# EAGLE schematic Lichtsteuerung (EAGLE 6.6.0)

## Sheet 1 of 2
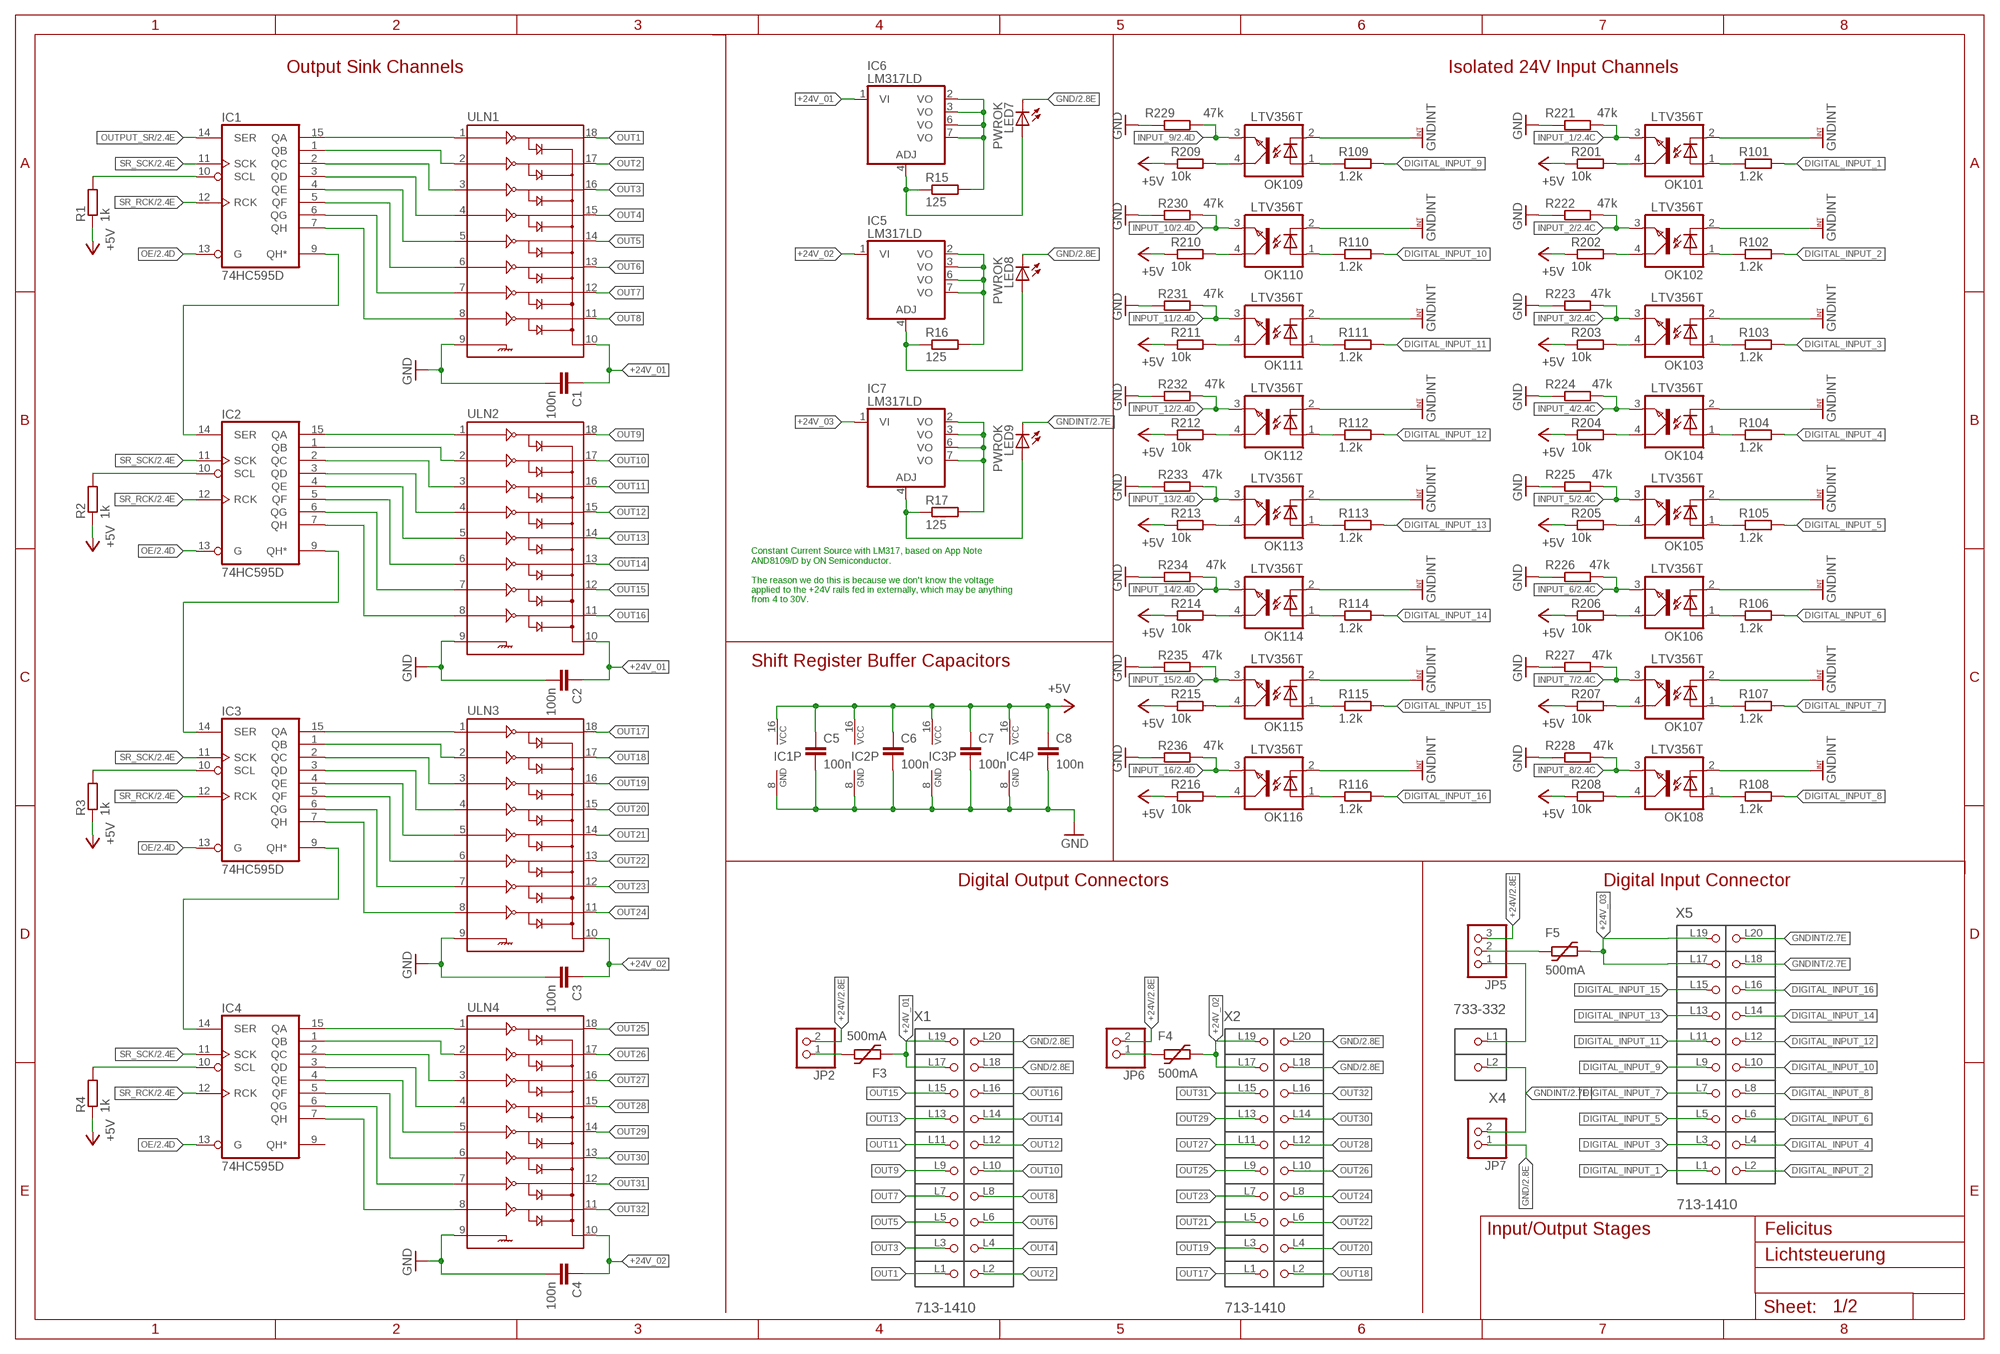
[diagram p0: schematic, sheet 1]

### Parts
C1  100n  C-EUC0805  [C0805]
C2  100n  C-EUC0805  [C0805]
C3  100n  C-EUC0805  [C0805]
C4  100n  C-EUC0805  [C0805]
C5  100n  C-EUC0805  [C0805]
C6  100n  C-EUC0805  [C0805]
C7  100n  C-EUC0805  [C0805]
C8  100n  C-EUC0805  [C0805]
F3  500mA  1812L  [1812L]
F4  500mA  1812L  [1812L]
F5  500mA  1812L  [1812L]
IC1  74HC595D  [SO16]
IC2  74HC595D  [SO16]
IC3  74HC595D  [SO16]
IC4  74HC595D  [SO16]
IC5  LM317LD  [SO08]
IC6  LM317LD  [SO08]
IC7  LM317LD  [SO08]
JP2  PINHD-1X2  [1X02]
JP5  PINHD-1X3  [1X03]
JP6  PINHD-1X2  [1X02]
JP7  PINHD-1X2  [1X02]
LED7  PWROK  LEDCHIP-LED0805  [CHIP-LED0805]
LED8  PWROK  LEDCHIP-LED0805  [CHIP-LED0805]
LED9  PWROK  LEDCHIP-LED0805  [CHIP-LED0805]
OK101  LTV356T  LTV816S  [SMD4]
OK102  LTV356T  LTV816S  [SMD4]
OK103  LTV356T  LTV816S  [SMD4]
OK104  LTV356T  LTV816S  [SMD4]
OK105  LTV356T  LTV816S  [SMD4]
OK106  LTV356T  LTV816S  [SMD4]
OK107  LTV356T  LTV816S  [SMD4]
OK108  LTV356T  LTV816S  [SMD4]
OK109  LTV356T  LTV816S  [SMD4]
OK110  LTV356T  LTV816S  [SMD4]
OK111  LTV356T  LTV816S  [SMD4]
OK112  LTV356T  LTV816S  [SMD4]
OK113  LTV356T  LTV816S  [SMD4]
OK114  LTV356T  LTV816S  [SMD4]
OK115  LTV356T  LTV816S  [SMD4]
OK116  LTV356T  LTV816S  [SMD4]
R1  1k  R-EU_R0805  [R0805]
R2  1k  R-EU_R0805  [R0805]
R3  1k  R-EU_R0805  [R0805]
R4  1k  R-EU_R0805  [R0805]
R15  125  R-EU_R0805  [R0805]
R16  125  R-EU_R0805  [R0805]
R17  125  R-EU_R0805  [R0805]
R101  1.2k  R-EU_R0805  [R0805]
R102  1.2k  R-EU_R0805  [R0805]
R103  1.2k  R-EU_R0805  [R0805]
R104  1.2k  R-EU_R0805  [R0805]
R105  1.2k  R-EU_R0805  [R0805]
R106  1.2k  R-EU_R0805  [R0805]
R107  1.2k  R-EU_R0805  [R0805]
R108  1.2k  R-EU_R0805  [R0805]
R109  1.2k  R-EU_R0805  [R0805]
R110  1.2k  R-EU_R0805  [R0805]
R111  1.2k  R-EU_R0805  [R0805]
R112  1.2k  R-EU_R0805  [R0805]
R113  1.2k  R-EU_R0805  [R0805]
R114  1.2k  R-EU_R0805  [R0805]
R115  1.2k  R-EU_R0805  [R0805]
R116  1.2k  R-EU_R0805  [R0805]
R201  10k  R-EU_R0805  [R0805]
R202  10k  R-EU_R0805  [R0805]
R203  10k  R-EU_R0805  [R0805]
R204  10k  R-EU_R0805  [R0805]
R205  10k  R-EU_R0805  [R0805]
R206  10k  R-EU_R0805  [R0805]
R207  10k  R-EU_R0805  [R0805]
R208  10k  R-EU_R0805  [R0805]
R209  10k  R-EU_R0805  [R0805]
R210  10k  R-EU_R0805  [R0805]
R211  10k  R-EU_R0805  [R0805]
R212  10k  R-EU_R0805  [R0805]
R213  10k  R-EU_R0805  [R0805]
R214  10k  R-EU_R0805  [R0805]
R215  10k  R-EU_R0805  [R0805]
R216  10k  R-EU_R0805  [R0805]
R221  47k  R-EU_R0805  [R0805]
R222  47k  R-EU_R0805  [R0805]
R223  47k  R-EU_R0805  [R0805]
R224  47k  R-EU_R0805  [R0805]
R225  47k  R-EU_R0805  [R0805]
R226  47k  R-EU_R0805  [R0805]
R227  47k  R-EU_R0805  [R0805]
R228  47k  R-EU_R0805  [R0805]
R229  47k  R-EU_R0805  [R0805]
R230  47k  R-EU_R0805  [R0805]
R231  47k  R-EU_R0805  [R0805]
R232  47k  R-EU_R0805  [R0805]
R233  47k  R-EU_R0805  [R0805]
R234  47k  R-EU_R0805  [R0805]
R235  47k  R-EU_R0805  [R0805]
R236  47k  R-EU_R0805  [R0805]
ULN1  ULN2803SOICW  [SO18L]
ULN2  ULN2803SOICW  [SO18L]
ULN3  ULN2803SOICW  [SO18L]
ULN4  ULN2803SOICW  [SO18L]
X1  713-1410  [P-713-1410]
X2  713-1410  [P-713-1410]
X4  733-332  [P-733-332]
X5  713-1410  [P-713-1410]

### Nets
+5V: C5.1 C6.1 C7.1 C8.1 IC1.16(VCC) IC2.16(VCC) IC3.16(VCC) IC4.16(VCC) R1.1 R2.1 R3.1 R4.1 R201.1 R202.1 R203.1 R204.1 R205.1 R206.1 R207.1 R208.1 R209.1 R210.1 R211.1 R212.1 R213.1 R214.1 R215.1 R216.1 ; also sheet 2
+24V [24v-2a]: JP2.2 JP5.3 JP6.2 ; also sheet 2
+24V_01 [24v-2a]: C1.1 C2.1 F3.P$1 IC6.1(VI) ULN1.10 ULN2.10 X1.L17 X1.L19
+24V_02 [24v-2a]: C3.1 C4.1 F4.P$2 IC5.1(VI) ULN3.10 ULN4.10 X2.L17 X2.L19
+24V_03 [24v-2a]: F5.P$2 IC7.1(VI) X5.L17 X5.L19
DIGITAL_INPUT_1: R101.2 X5.L1
DIGITAL_INPUT_2: R102.2 X5.L2
DIGITAL_INPUT_3: R103.2 X5.L3
DIGITAL_INPUT_4: R104.2 X5.L4
DIGITAL_INPUT_5: R105.2 X5.L5
DIGITAL_INPUT_6: R106.2 X5.L6
DIGITAL_INPUT_7: R107.2 X5.L7
DIGITAL_INPUT_8: R108.2 X5.L8
DIGITAL_INPUT_9: R109.2 X5.L9
DIGITAL_INPUT_10: R110.2 X5.L10
DIGITAL_INPUT_11: R111.2 X5.L11
DIGITAL_INPUT_12: R112.2 X5.L12
DIGITAL_INPUT_13: R113.2 X5.L13
DIGITAL_INPUT_14: R114.2 X5.L14
DIGITAL_INPUT_15: R115.2 X5.L15
DIGITAL_INPUT_16: R116.2 X5.L16
GND: C1.2 C2.2 C3.2 C4.2 C5.2 C6.2 C7.2 C8.2 IC1.8(GND) IC2.8(GND) IC3.8(GND) IC4.8(GND) JP7.1 LED7.C LED8.C R221.1 R222.1 R223.1 R224.1 R225.1 R226.1 R227.1 R228.1 R229.1 R230.1 R231.1 R232.1 R233.1 R234.1 R235.1 R236.1 ULN1.9 ULN2.9 ULN3.9 ULN4.9 X1.L18 X1.L20 X2.L18 X2.L20 ; also sheet 2
GNDINT: JP7.2 LED9.C OK101.2(C) OK102.2(C) OK103.2(C) OK104.2(C) OK105.2(C) OK106.2(C) OK107.2(C) OK108.2(C) OK109.2(C) OK110.2(C) OK111.2(C) OK112.2(C) OK113.2(C) OK114.2(C) OK115.2(C) OK116.2(C) X4.L2(P2) X5.L18 X5.L20 ; also sheet 2
INPUT_1: OK101.3(EMIT) R221.2 ; also sheet 2
INPUT_2: OK102.3(EMIT) R222.2 ; also sheet 2
INPUT_3: OK103.3(EMIT) R223.2 ; also sheet 2
INPUT_4: OK104.3(EMIT) R224.2 ; also sheet 2
INPUT_5: OK105.3(EMIT) R225.2 ; also sheet 2
INPUT_6: OK106.3(EMIT) R226.2 ; also sheet 2
INPUT_7: OK107.3(EMIT) R227.2 ; also sheet 2
INPUT_8: OK108.3(EMIT) R228.2 ; also sheet 2
INPUT_9: OK109.3(EMIT) R229.2 ; also sheet 2
INPUT_10: OK110.3(EMIT) R230.2 ; also sheet 2
INPUT_11: OK111.3(EMIT) R231.2 ; also sheet 2
INPUT_12: OK112.3(EMIT) R232.2 ; also sheet 2
INPUT_13: OK113.3(EMIT) R233.2 ; also sheet 2
INPUT_14: OK114.3(EMIT) R234.2 ; also sheet 2
INPUT_15: OK115.3(EMIT) R235.2 ; also sheet 2
INPUT_16: OK116.3(EMIT) R236.2 ; also sheet 2
N$1: IC1.15(QA) ULN1.1
N$2: IC1.1(QB) ULN1.2
N$3: IC1.2(QC) ULN1.3
N$4: IC1.3(QD) ULN1.4
N$5: IC1.4(QE) ULN1.5
N$6: IC1.5(QF) ULN1.6
N$7: IC1.6(QG) ULN1.7
N$8: IC1.7(QH) ULN1.8
N$9: IC2.15(QA) ULN2.1
N$10: IC2.1(QB) ULN2.2
N$11: IC2.2(QC) ULN2.3
N$12: IC2.3(QD) ULN2.4
N$13: IC2.4(QE) ULN2.5
N$14: IC2.5(QF) ULN2.6
N$15: IC2.6(QG) ULN2.7
N$16: IC2.7(QH) ULN2.8
N$17: IC3.15(QA) ULN3.1
N$18: IC3.1(QB) ULN3.2
N$19: IC3.2(QC) ULN3.3
N$20: IC3.3(QD) ULN3.4
N$21: IC3.4(QE) ULN3.5
N$22: IC3.5(QF) ULN3.6
N$23: IC3.6(QG) ULN3.7
N$24: IC3.7(QH) ULN3.8
N$25: IC4.15(QA) ULN4.1
N$26: IC4.1(QB) ULN4.2
N$27: IC4.2(QC) ULN4.3
N$28: IC4.3(QD) ULN4.4
N$29: IC4.4(QE) ULN4.5
N$30: IC4.5(QF) ULN4.6
N$31: IC4.6(QG) ULN4.7
N$32: IC4.7(QH) ULN4.8
N$33: IC1.9(QH*) IC2.14(SER)
N$34: IC2.9(QH*) IC3.14(SER)
N$35: IC3.9(QH*) IC4.14(SER)
N$36: IC1.10(SCL) R1.2
N$37: IC2.10(SCL) R2.2
N$38: IC3.10(SCL) R3.2
N$39: IC4.10(SCL) R4.2
N$46: F5.P$1 JP5.2
N$47: JP5.1 X4.L1(P1)
N$49: OK101.1(A) R101.1
N$50: OK101.4(COL) R201.2
N$51: OK102.1(A) R102.1
N$52: OK102.4(COL) R202.2
N$54: OK103.1(A) R103.1
N$55: OK103.4(COL) R203.2
N$56: OK104.1(A) R104.1
N$57: OK104.4(COL) R204.2
N$58: OK105.1(A) R105.1
N$59: OK105.4(COL) R205.2
N$60: OK106.1(A) R106.1
N$61: OK106.4(COL) R206.2
N$62: OK107.1(A) R107.1
N$63: OK107.4(COL) R207.2
N$64: OK108.1(A) R108.1
N$65: OK108.4(COL) R208.2
N$66: OK109.1(A) R109.1
N$67: OK109.4(COL) R209.2
N$68: OK110.1(A) R110.1
N$69: OK110.4(COL) R210.2
N$70: OK111.1(A) R111.1
N$74: F4.P$1 JP6.1
N$75: OK111.4(COL) R211.2
N$76: F3.P$2 JP2.1
N$78: OK112.1(A) R112.1
N$80: IC5.4(ADJ) LED8.A R16.1
N$81: OK112.4(COL) R212.2
N$82: IC5.2(VO) IC5.3(VO) IC5.6(VO) IC5.7(VO) R16.2
N$83: IC7.4(ADJ) LED9.A R17.1
N$84: OK113.1(A) R113.1
N$85: IC6.4(ADJ) LED7.A R15.1
N$86: IC6.2(VO) IC6.3(VO) IC6.6(VO) IC6.7(VO) R15.2
N$87: OK113.4(COL) R213.2
N$88: IC7.2(VO) IC7.3(VO) IC7.6(VO) IC7.7(VO) R17.2
N$90: OK114.1(A) R114.1
N$93: OK114.4(COL) R214.2
N$96: OK115.1(A) R115.1
N$105: OK115.4(COL) R215.2
N$107: OK116.1(A) R116.1
N$108: OK116.4(COL) R216.2
OE: IC1.13(G) IC2.13(G) IC3.13(G) IC4.13(G) ; also sheet 2
OUT1 [24v-500ma]: ULN1.18 X1.L1
OUT2 [24v-500ma]: ULN1.17 X1.L2
OUT3 [24v-500ma]: ULN1.16 X1.L3
OUT4 [24v-500ma]: ULN1.15 X1.L4
OUT5 [24v-500ma]: ULN1.14 X1.L5
OUT6 [24v-500ma]: ULN1.13 X1.L6
OUT7 [24v-500ma]: ULN1.12 X1.L7
OUT8 [24v-500ma]: ULN1.11 X1.L8
OUT9 [24v-500ma]: ULN2.18 X1.L9
OUT10 [24v-500ma]: ULN2.17 X1.L10
OUT11 [24v-500ma]: ULN2.16 X1.L11
OUT12 [24v-500ma]: ULN2.15 X1.L12
OUT13 [24v-500ma]: ULN2.14 X1.L13
OUT14 [24v-500ma]: ULN2.13 X1.L14
OUT15 [24v-500ma]: ULN2.12 X1.L15
OUT16 [24v-500ma]: ULN2.11 X1.L16
OUT17 [24v-500ma]: ULN3.18 X2.L1
OUT18 [24v-500ma]: ULN3.17 X2.L2
OUT19 [24v-500ma]: ULN3.16 X2.L3
OUT20 [24v-500ma]: ULN3.15 X2.L4
OUT21 [24v-500ma]: ULN3.14 X2.L5
OUT22 [24v-500ma]: ULN3.13 X2.L6
OUT23 [24v-500ma]: ULN3.12 X2.L7
OUT24 [24v-500ma]: ULN3.11 X2.L8
OUT25 [24v-500ma]: ULN4.18 X2.L9
OUT26 [24v-500ma]: ULN4.17 X2.L10
OUT27 [24v-500ma]: ULN4.16 X2.L11
OUT28 [24v-500ma]: ULN4.15 X2.L12
OUT29 [24v-500ma]: ULN4.14 X2.L13
OUT30 [24v-500ma]: ULN4.13 X2.L14
OUT31 [24v-500ma]: ULN4.12 X2.L15
OUT32 [24v-500ma]: ULN4.11 X2.L16
OUTPUT_SR: IC1.14(SER) ; also sheet 2
SR_RCK: IC1.12(RCK) IC2.12(RCK) IC3.12(RCK) IC4.12(RCK) ; also sheet 2
SR_SCK: IC1.11(SCK) IC2.11(SCK) IC3.11(SCK) IC4.11(SCK) ; also sheet 2
Unconnected: IC4.9(QH*)

### Notes on the sheet
- Output Sink Channels | Isolated 24V Input Channels
- Constant Current Source with LM317, based on App Note
  AND8109/D by ON Semiconductor.
  
  The reason we do this is because we don't know the voltage
  applied to the +24V rails fed in externally, which may be anything
  from 4 to 30V.
- Shift Register Buffer Capacitors
- Digital Output Connectors | Digital Input Connector
- Input/Output Stages | Felicitus

## Sheet 2 of 2
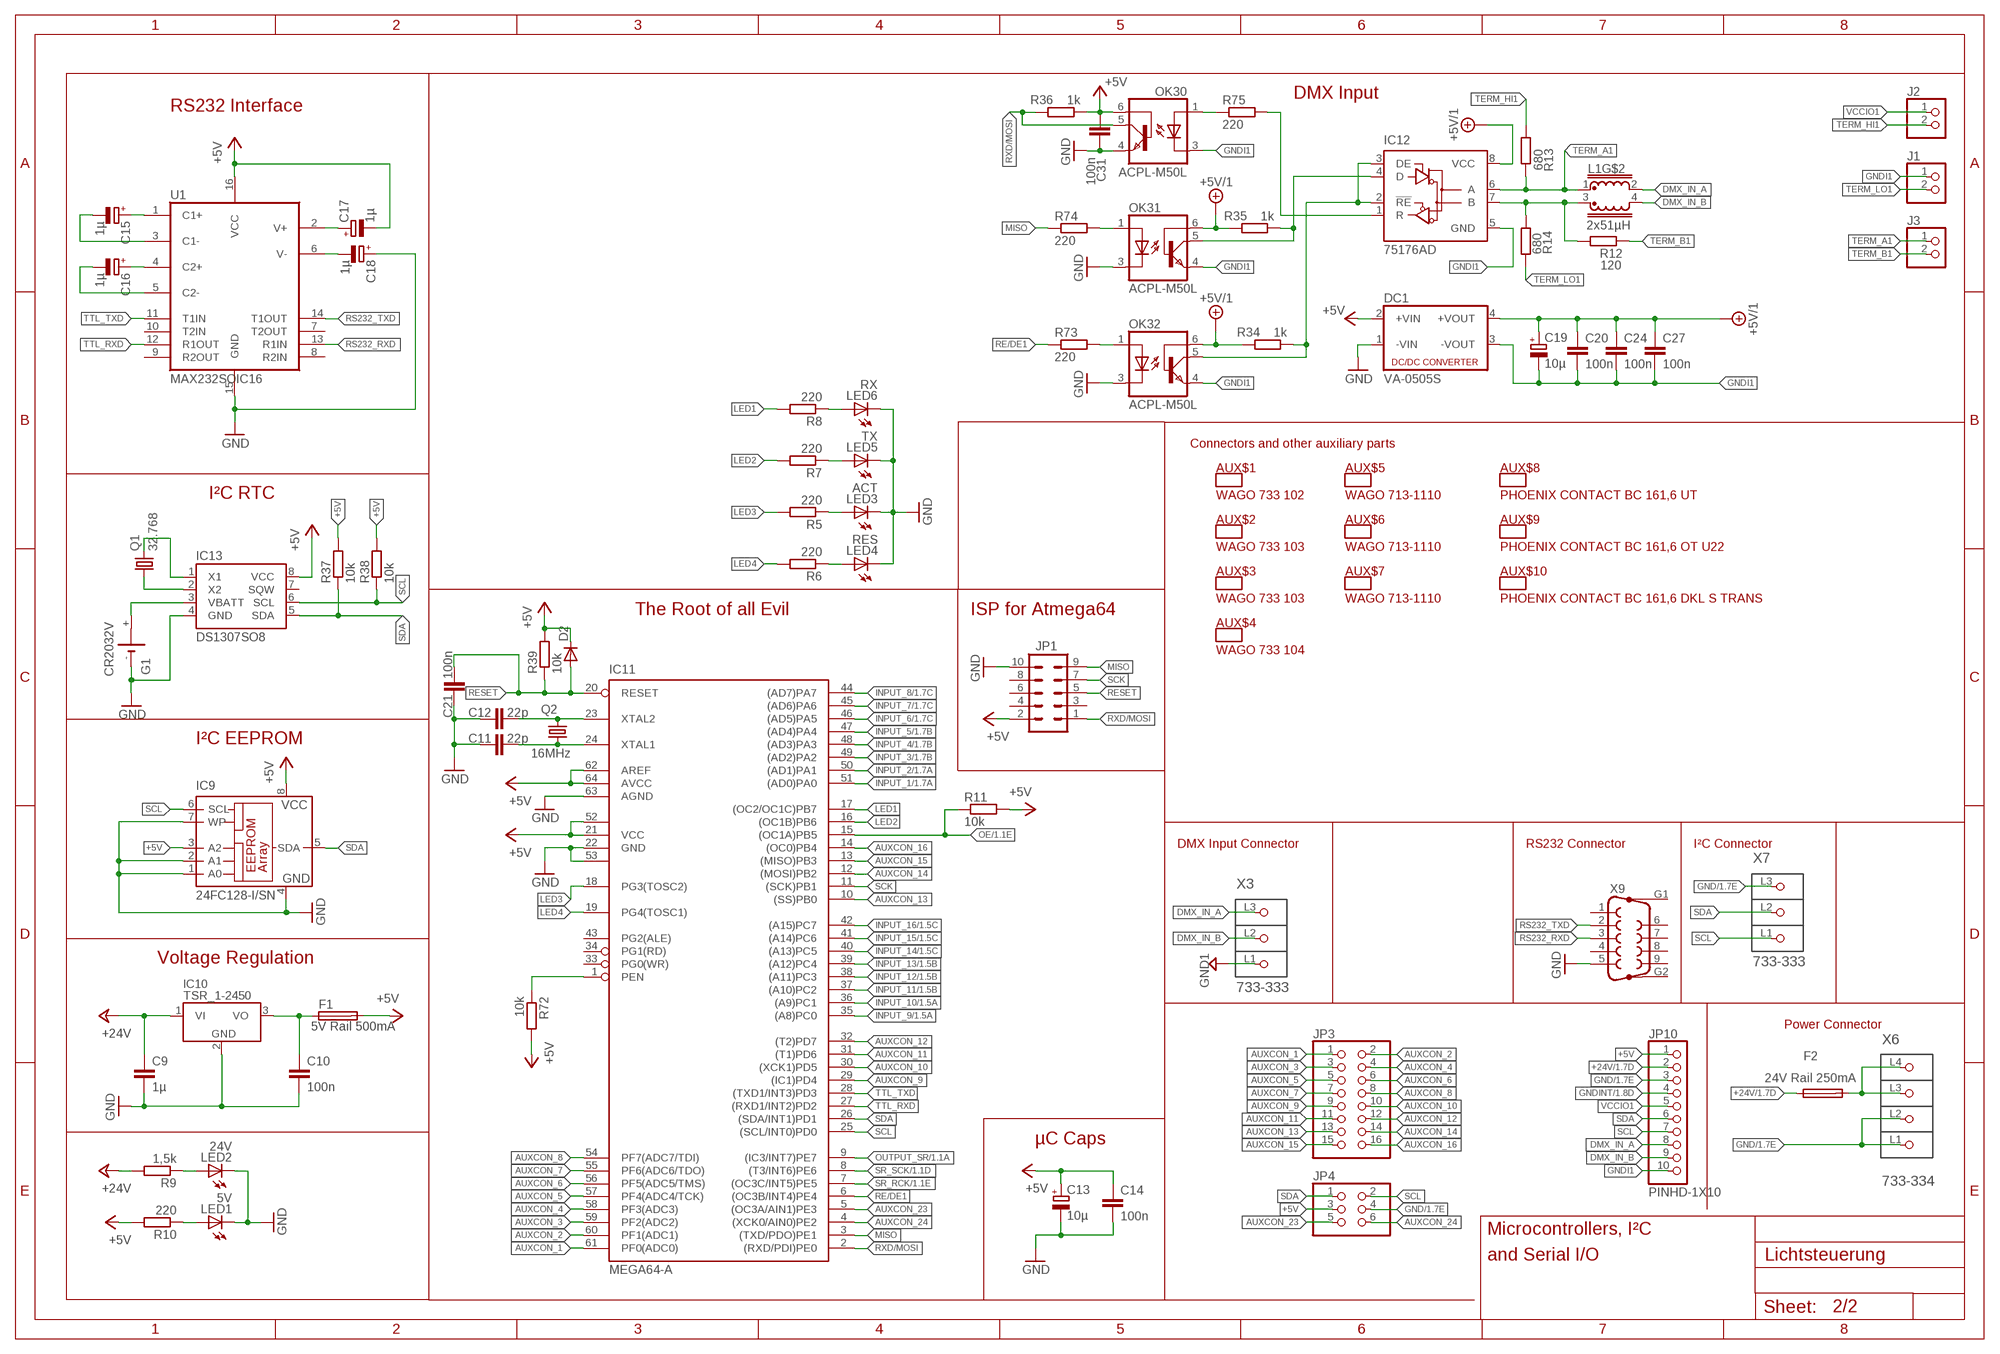
[diagram p1: schematic, sheet 2]
AUX$1 (DUMMY): OC_REICHELT: WAGO 733-102
AUX$2 (DUMMY): OC_REICHELT: WAGO 733-103
AUX$3 (DUMMY): OC_REICHELT: WAGO 733-103
AUX$4 (DUMMY): OC_REICHELT: WAGO 733-104
AUX$5 (DUMMY): OC_REICHELT: WAGO 713-1110
AUX$6 (DUMMY): OC_REICHELT: WAGO 713-1110
AUX$7 (DUMMY): OC_REICHELT: WAGO 713-1110
AUX$8 (DUMMY): OC_CONRAD: 702576
AUX$9 (DUMMY): OC_CONRAD: 702578
AUX$10 (DUMMY): OC_CONRAD: 702581

### Parts
C9  1µ  C-EUC0805  [C0805]
C10  100n  C-EUC0805  [C0805]
C11  22p  C-EUC0805  [C0805]
C12  22p  C-EUC0805  [C0805]
C13  10µ  CPOL-EUC/6032-28R  [C/6032-28R]
C14  100n  C-EUC0805  [C0805]
C15  1µ  CPOL-EUA/3216-18R  [A/3216-18R]
C16  1µ  CPOL-EUA/3216-18R  [A/3216-18R]
C17  1µ  CPOL-EUA/3216-18R  [A/3216-18R]
C18  1µ  CPOL-EUA/3216-18R  [A/3216-18R]
C19  10µ  CPOL-EUC/6032-28R  [C/6032-28R]
C20  100n  C-EUC0805  [C0805]
C21  100n  C-EUC0805  [C0805]
C24  100n  C-EUC0805  [C0805]
C27  100n  C-EUC0805  [C0805]
C31  100n  C-EUC0805  [C0805]
D2  DIODE-SOD323-R  [SOD323-R]
DC1  VA-0505S  [4SIL]
F1  5V Rail 500mA  SMD-MICRO-FUSE-BLOCK  [OMNIBLOK]
F2  24V Rail 250mA  SMD-MICRO-FUSE-BLOCK  [OMNIBLOK]
G1  CR2032V  [CR2032V2]
IC9  24FC128-I/SN  24AA01SM  [SO-08M]
IC10  TSR_1-2450  [TSR-1]
IC11  MEGA64-A  [TQFP64]
IC12  75176AD  [D_R-PDSO-G8]
IC13  DS1307SO8  [SO08]
J1  PINHD-1X2  [1X02]
J2  PINHD-1X2  [1X02]
J3  PINHD-1X2  [1X02]
JP1  ML10  [ML10]
JP3  PINHD-2X8  [2X08]
JP4  PINHD-2X3  [2X03]
JP10  PINHD-1X10  [1X10-BIG]
L1  2x51µH  EPCOS_B82790C0  [EPCOS_B82790_SERIES]
LED1  5V  LEDCHIP-LED0805  [CHIP-LED0805]
LED2  24V  LEDCHIP-LED0805  [CHIP-LED0805]
LED3  ACT  LEDCHIP-LED0805  [CHIP-LED0805]
LED4  RES  LEDCHIP-LED0805  [CHIP-LED0805]
LED5  TX  LEDCHIP-LED0805  [CHIP-LED0805]
LED6  RX  LEDCHIP-LED0805  [CHIP-LED0805]
OK30  ACPL-M50L  [JEDEC_MS-012-AA_SOIC5]
OK31  ACPL-M50L  [JEDEC_MS-012-AA_SOIC5]
OK32  ACPL-M50L  [JEDEC_MS-012-AA_SOIC5]
Q1  32.768  MC-306  [MC-306]
Q2  16MHz  CRYSTALMJ  [MJ]
R5  220  R-EU_R0805  [R0805]
R6  220  R-EU_R0805  [R0805]
R7  220  R-EU_R0805  [R0805]
R8  220  R-EU_R0805  [R0805]
R9  1,5k  R-EU_R0805  [R0805]
R10  220  R-EU_R0805  [R0805]
R11  10k  R-EU_R0805  [R0805]
R12  120  R-EU_R0805  [R0805]
R13  680  R-EU_R0805  [R0805]
R14  680  R-EU_R0805  [R0805]
R34  1k  R-EU_R0805  [R0805]
R35  1k  R-EU_R0805  [R0805]
R36  1k  R-EU_R0805  [R0805]
R37  10k  R-EU_R0805  [R0805]
R38  10k  R-EU_R0805  [R0805]
R39  10k  R-EU_R0805  [R0805]
R72  10k  R-EU_R0805  [R0805]
R73  220  R-EU_R0805  [R0805]
R74  220  R-EU_R0805  [R0805]
R75  220  R-EU_R0805  [R0805]
U1  MAX232SOIC16  [SO016]
X3  733-333  [P-733-333]
X6  733-334  [P-733-334]
X7  733-333  [P-733-333]
X9  F09VP  [F09VP]

### Nets
+5V: C13.+ C14.1 C17.- C31.1 D2.C DC1.2(+VIN) F1.P$2 IC9.3(A2) IC9.8(VCC) IC11.21(VCC) IC11.52(VCC1) IC11.62(AREF) IC11.64(AVCC) IC13.8(VCC) JP1.2 JP4.3 JP10.1 OK30.6(BAS) R10.2 R11.2 R36.1 R37.2 R38.2 R39.2 R72.2 U1.16(VCC) ; also sheet 1
+24V [24v-2a]: C9.1 F2.P$1 IC10.1(VI) JP10.2 R9.2 ; also sheet 1
+24VIN [24v-2a]: F2.P$2 X6.L3(P3) X6.L4(P4)
AUXCON_1: IC11.61(PF0(ADC0)) JP3.1
AUXCON_2: IC11.60(PF1(ADC1)) JP3.2
AUXCON_3: IC11.59(PF2(ADC2)) JP3.3
AUXCON_4: IC11.58(PF3(ADC3)) JP3.4
AUXCON_5: IC11.57(PF4(ADC4/TCK)) JP3.5
AUXCON_6: IC11.56(PF5(ADC5/TMS)) JP3.6
AUXCON_7: IC11.55(PF6(ADC6/TDO)) JP3.7
AUXCON_8: IC11.54(PF7(ADC7/TDI)) JP3.8
AUXCON_9: IC11.29((IC1)PD4) JP3.9
AUXCON_10: IC11.30((XCK1)PD5) JP3.10
AUXCON_11: IC11.31((T1)PD6) JP3.11
AUXCON_12: IC11.32((T2)PD7) JP3.12
AUXCON_13: IC11.10((SS)PB0) JP3.13
AUXCON_14: IC11.12((MOSI)PB2) JP3.14
AUXCON_15: IC11.13((MISO)PB3) JP3.15
AUXCON_16: IC11.14((OC0)PB4) JP3.16
AUXCON_23: IC11.5((OC3A/AIN1)PE3) JP4.5
AUXCON_24: IC11.4((XCK0/AIN0)PE2) JP4.6
DMX_IN_A: JP10.8 L1.2 X3.L3(P3)
DMX_IN_B: JP10.9 L1.4 X3.L2(P2)
GND: C9.2 C10.2 C11.2 C12.2 C13.- C14.2 C18.+ C21.2 C31.2 DC1.1(-VIN) G1.- IC9.1(A0) IC9.2(A1) IC9.4(GND) IC9.7(WP) IC10.2(GND) IC11.22(GND) IC11.53(GND1) IC11.63(AGND) IC13.4(GND) JP1.10 JP4.4 JP10.3 LED1.C LED2.C LED3.C LED4.C LED5.C LED6.C OK30.4(EMI) OK31.3(C) OK32.3(C) U1.15(GND) X6.L1(P1) X6.L2(P2) X7.L3(P3) X9.5 ; also sheet 1
GNDI1: C19.- C20.2 C24.2 C27.2 DC1.3(-VOUT) IC12.5(GND) J1.1 JP10.10 OK30.3(C) OK31.4(EMI) OK32.4(EMI) X3.L1(P1) ; supply symbol labelled GND1
GNDINT: JP10.4 ; also sheet 1
INPUT_1: IC11.51((AD0)PA0) ; also sheet 1
INPUT_2: IC11.50((AD1)PA1) ; also sheet 1
INPUT_3: IC11.49((AD2)PA2) ; also sheet 1
INPUT_4: IC11.48((AD3)PA3) ; also sheet 1
INPUT_5: IC11.47((AD4)PA4) ; also sheet 1
INPUT_6: IC11.46((AD5)PA5) ; also sheet 1
INPUT_7: IC11.45((AD6)PA6) ; also sheet 1
INPUT_8: IC11.44((AD7)PA7) ; also sheet 1
INPUT_9: IC11.35((A8)PC0) ; also sheet 1
INPUT_10: IC11.36((A9)PC1) ; also sheet 1
INPUT_11: IC11.37((A10)PC2) ; also sheet 1
INPUT_12: IC11.38((A11)PC3) ; also sheet 1
INPUT_13: IC11.39((A12)PC4) ; also sheet 1
INPUT_14: IC11.40((A13)PC5) ; also sheet 1
INPUT_15: IC11.41((A14)PC6) ; also sheet 1
INPUT_16: IC11.42((A15)PC7) ; also sheet 1
LED1: IC11.17((OC2/OC1C)PB7) R8.2
LED2: IC11.16((OC1B)PB6) R7.2
LED3: IC11.18(PG3(TOSC2)) R5.2
LED4: IC11.19(PG4(TOSC1)) R6.2
MISO: IC11.3((TXD/PDO)PE1) JP1.9 R74.1
N$40: G1.+ IC13.3(VBATT)
N$41: C11.1 IC11.24(XTAL1) Q2.P3
N$42: IC13.2(X2) Q1.1
N$43: IC13.1(X1) Q1.4
N$44: C12.1 IC11.23(XTAL2) Q2.P1
N$45: LED6.A R8.1
N$48: LED5.A R7.1
N$53: LED3.A R5.1
N$71: C15.+ U1.1(C1+)
N$72: C15.- U1.3(C1-)
N$73: LED4.A R6.1
N$77: LED1.A R10.1
N$79: LED2.A R9.1
N$97: IC11.1(PEN) R72.1
N$98: C16.+ U1.4(C2+)
N$99: C16.- U1.5(C2-)
N$100: C10.1 F1.P$1 IC10.3(VO)
N$101: IC12.7(B) L1.3 R12.2 R14.2
N$104: OK30.1(A) R75.1
N$116: OK31.1(A) R74.2
N$133: OK32.1(A) R73.2
N$156: C18.- U1.6(V-)
N$157: C17.+ U1.2(V+)
OE: IC11.15((OC1A)PB5) R11.1 ; also sheet 1
OUTPUT_SR: IC11.9((IC3/INT7)PE7) ; also sheet 1
RE/DE1: IC11.6((OC3B/INT4)PE4) R73.1
RE_OUT: IC12.2(!RE) IC12.3(DE) OK32.5(COL) R34.1
REC$1: IC12.1(R) R75.2
RESET: C21.1 D2.A IC11.20(RESET) JP1.5 R39.1
RS232_RXD: U1.13(R1IN) X9.3
RS232_TXD: U1.14(T1OUT) X9.2
RXD/MOSI: IC11.2((RXD/PDI)PE0) JP1.1 OK30.5(COL) R36.2
SCK: IC11.11((SCK)PB1) JP1.7
SCL: IC9.6(SCL) IC11.25((SCL/INT0)PD0) IC13.6(SCL) JP4.2 JP10.7 R38.1 X7.L1(P1)
SDA: IC9.5(SDA) IC11.26((SDA/INT1)PD1) IC13.5(SDA) JP4.1 JP10.6 R37.1 X7.L2(P2)
SR_RCK: IC11.7((OC3C/INT5)PE5) ; also sheet 1
SR_SCK: IC11.8((T3/INT6)PE6) ; also sheet 1
TERM_A1: IC12.6(A) J3.1 L1.1 R13.1
TERM_B1: J3.2 R12.1
TERM_HI1: J2.2 R13.2
TERM_LO1: J1.2 R14.1
TTL_RXD: IC11.27((RXD1/INT2)PD2) U1.12(R1OUT)
TTL_TXD: IC11.28((TXD1/INT3)PD3) U1.11(T1IN)
TXD_OUT: IC12.4(D) OK31.5(COL) R35.1
VCCIO1: C19.+ C20.1 C24.1 C27.1 DC1.4(+VOUT) IC12.8(VCC) J2.1 JP10.5 OK31.6(BAS) OK32.6(BAS) R34.2 R35.2 ; supply symbol labelled +5V/1
Unconnected: G1.+@1(+) IC11.33(PG0(WR)) IC11.34(PG1(RD)) IC11.43(PG2(ALE)) IC13.7(SQW) JP1.3 JP1.4 JP1.6 JP1.8 Q2.P2(GND) Q2.P4(GND1) U1.7(T2OUT) U1.8(R2IN) U1.9(R2OUT) U1.10(T2IN) X9.1 X9.4 X9.6 X9.7 X9.8 X9.9 X9.G1 X9.G2

### Notes on the sheet
- DMX Input
- RS232 Interface
- Connectors and other auxiliary parts
- I²C RTC
- The Root of all Evil | ISP for Atmega64
- I²C EEPROM
- DMX Input Connector | RS232 Connector | I²C Connector
- Voltage Regulation
- Power Connector
- µC Caps
- Microcontrollers, I²C
- and Serial I/O

## Library data of the parts
C1-C8 C10 C20 C24 C27 C31 = rcl:C-EU: CAPACITOR, European symbol; OC_REICHELT: X7R-G0805 100N
C9 = rcl:C-EU: CAPACITOR, European symbol; OC_REICHELT: X7R-G0805 1,0/50
C11 C12 C21 = rcl:C-EU: CAPACITOR, European symbol; OC_REICHELT: NPO-G0805 22P
C13 C19 = rcl:CPOL-EU: POLARIZED CAPACITOR, European symbol; PARTKEEPR_SKU: 2607
C14 = resistor:C-EU: CAPACITOR, European symbol; OC_REICHELT: X7R-G0805 100N
C15-C18 = resistor:CPOL-EU: POLARIZED CAPACITOR, European symbol; PARTKEEPR_SKU: 2609
D2 = diode:DIODE-: DIODE; OC_DIGIKEY: 497-10893-1-ND; PRICE_100: 0.092
DC1 = dc-dc-converter:VA-*?: DC DC Converter Single Output, 1 Watt Motien Technology Co.,Ltd. Source: va-serie.pdf; OC_FARNELL: unknown; OC_NEWARK: unknown; OC_REICHELT: SIM1-0505 SIL4
F1 = f-lf-omniblok-s:SMD-MICRO-FUSE; OC_REICHELT: SMD-HASF 0,5A
F2 = f-lf-omniblok-s:SMD-MICRO-FUSE; OC_REICHELT: SMD-HASF 0,25A
F3-F5 = ptc-littlefuse:1812L; OC_REICHELT: PTC194600-050
G1 = cr2032v2:CR2032V: LI BATTERY Varta; OC_REICHELT: KZH 20PCB-V
IC1-IC4 = 74xx-eu:74*595: 8-bit SHIFT REGISTER, output latch; OC_REICHELT: SMD HC 595
IC5-IC7 = linear:LM317LD: LOW CURRENT 1.2 TO 37V ADJUSTABLE VOLTAGE REGULATOR Source: http://pdf.alldatasheet.com; OC_REICHELT: LM 317 LD
IC9 = microchip:24*: Serial EEPROM I2C; MF: MICROCHIP; MPN: 24AA01-I/SN; OC_FARNELL: 1331268; OC_NEWARK: 92C6793; OC_REICHELT: 24FC1025-I/SM
IC10 = _traco_tsr-1:TSR_1-*: TRACO TSR-1 Series Point-of-Load DC/DC-Converters Vi max. 36 V; Vo = (1.2 .. 15)V ±2%; Io = 0 .. 1 A SIP-Package (drop-in replacement for 78xx linear voltage regulators in TO220-package, vertically assembled) Source: www.tracopower.com Technologies: TSR 1- Vi (V) Vo (V) ±2% Io = 0 .. 1 A 24_ ( generic ) 2412 4.6 .. 36 1.2 2415 4.6 .. 36 1.5 2418 4.6 .. 36 1.8 2425 4.6 .. 36 2.5 2433 4.75.. 36 3.3 2450 6.5 .. 36 5.0 2465 9.0 .. 36 6.5 2490 12 .. 36 9.0 24120 15 .. 36 12 24150 18 .. 36 15 Author: Dipl.-Ing. FH Rainer Bayer HHN Hochschule Heilbronn, rainer.bayer@hs-heilbronn.de Ingenieurbüro ing-rb, mail@ing-rb.de; OC_REICHELT: TSR 1-2450
IC11 = avr-7:MEGA64: MICROCONTROLLER 64 Kbytes FLASH 4 Kbytes SRAM 2 Kbytes EEPROM DUAL USART 8-channel 10 bit ADC; OC_REICHELT: ATMEGA 2561-16AU
IC12 = 751xx:75176A: DIFFERENTIAL BUS TRANSCEIVER Source: http://focus.ti.com/lit/ds/symlink/sn75176a.pdf; OC_REICHELT: SN 75176BD
IC13 = SparkFun:DS1307; OC_REICHELT: DS 1307Z
J1-J3 JP2 JP6 JP7 = pinhead:PINHD-1X2: PIN HEADER
JP1 = con-ml:ML10: HARTING; OC_FARNELL: unknown; OC_NEWARK: unknown; OC_REICHELT: WSL 10G
JP3 = pinhead:PINHD-2X8: PIN HEADER; OC_REICHELT: MPE 087-2-016
JP4 = pinhead:PINHD-2X3: PIN HEADER; OC_REICHELT: MPE 087-2-006
JP5 = pinhead:PINHD-1X3: PIN HEADER
JP10 = adafruit:PINHD-1X10: Pin header 1x10 0.1" spacing With round pins
L1 = epcos-b82790c0:EPCOS_B82790C0: EPCOS B82790C0 Data and Signal Line Common Mode Choke; OC_DIGIKEY: 495-1868-1-ND
LED1 LED3-LED6 = led:LED: LED OSRAM: - CHIPLED LG R971, LG N971, LY N971, LG Q971, LY Q971, LO R971, LY R971 LH N974, LH R974 LS Q976, LO Q976, LY Q976 LO Q996 - Hyper CHIPLED LW Q18S LB Q993, LB Q99A, LB R99A - SideLED LS A670, LO A670, LY A670, LG A670, LP A670 LB A673, LV A673, LT A673, LW A673 LH A674 LY A675 LS A676, LA A676, LO A676, LY A676, LW A676 LS A679, LY A679, LG A679 - Hyper Micro SIDELED® LS Y876, LA Y876, LO Y876, LY Y876 LT Y87S - SmartLED LW L88C, LW L88S LB L89C, LB L89S, LG L890 LS L89K, LO L89K, LY L89K LS L896, LA L896, LO L896, LY L896 - TOPLED LS T670, LO T670, LY T670, LG T670, LP T670 LSG T670, LSP T670, LSY T670, LOP T670, LYG T670 LG T671, LOG T671, LSG T671 LB T673, LV T673, LT T673, LW T673 LH T674 LS T676, LA T676, LO T676, LY T676, LB T676, LH T676, LSB T676, LW T676 LB T67C, LV T67C, LT T67C, LS T67K, LO T67K, LY T67K, LW E67C LS E67B, LA E67B, LO E67B, LY E67B, LB E67C, LV E67C, LT E67C LW T67C LS T679, LY T679, LG T679 LS T770, LO T770, LY T770, LG T770, LP T770 LB T773, LV T773, LT T773, LW T773 LH T774 LS E675, LA E675, LY E675, LS T675 LS T776, LA T776, LO T776, LY T776, LB T776 LHGB T686 LT T68C, LB T68C - Hyper Mini TOPLED® LB M676 - Mini TOPLED Santana® LG M470 LS M47K, LO M47K, LY M47K Source: http://www.osram.convergy.de LUXEON: - LUMILED® LXK2-PW12-R00, LXK2-PW12-S00, LXK2-PW14-U00, LXK2-PW14-V00 LXK2-PM12-R00, LXK2-PM12-S00, LXK2-PM14-U00 LXK2-PE12-Q00, LXK2-PE12-R00, LXK2-PE12-S00, LXK2-PE14-T00, LXK2-PE14-U00 LXK2-PB12-K00, LXK2-PB12-L00, LXK2-PB12-M00, LXK2-PB14-N00, LXK2-PB14-P00, LXK2-PB14-Q00 LXK2-PR12-L00, LXK2-PR12-M00, LXK2-PR14-Q00, LXK2-PR14-R00 LXK2-PD12-Q00, LXK2-PD12-R00, LXK2-PD12-S00 LXK2-PH12-R00, LXK2-PH12-S00 LXK2-PL12-P00, LXK2-PL12-Q00, LXK2-PL12-R00 Source: www.luxeon.com KINGBRIGHT: KA-3528ASYC Source: www.kingbright.com; OC_REICHELT: SMD-LED 0805 GE
LED2 LED7-LED9 = led:LED: LED OSRAM: - CHIPLED LG R971, LG N971, LY N971, LG Q971, LY Q971, LO R971, LY R971 LH N974, LH R974 LS Q976, LO Q976, LY Q976 LO Q996 - Hyper CHIPLED LW Q18S LB Q993, LB Q99A, LB R99A - SideLED LS A670, LO A670, LY A670, LG A670, LP A670 LB A673, LV A673, LT A673, LW A673 LH A674 LY A675 LS A676, LA A676, LO A676, LY A676, LW A676 LS A679, LY A679, LG A679 - Hyper Micro SIDELED® LS Y876, LA Y876, LO Y876, LY Y876 LT Y87S - SmartLED LW L88C, LW L88S LB L89C, LB L89S, LG L890 LS L89K, LO L89K, LY L89K LS L896, LA L896, LO L896, LY L896 - TOPLED LS T670, LO T670, LY T670, LG T670, LP T670 LSG T670, LSP T670, LSY T670, LOP T670, LYG T670 LG T671, LOG T671, LSG T671 LB T673, LV T673, LT T673, LW T673 LH T674 LS T676, LA T676, LO T676, LY T676, LB T676, LH T676, LSB T676, LW T676 LB T67C, LV T67C, LT T67C, LS T67K, LO T67K, LY T67K, LW E67C LS E67B, LA E67B, LO E67B, LY E67B, LB E67C, LV E67C, LT E67C LW T67C LS T679, LY T679, LG T679 LS T770, LO T770, LY T770, LG T770, LP T770 LB T773, LV T773, LT T773, LW T773 LH T774 LS E675, LA E675, LY E675, LS T675 LS T776, LA T776, LO T776, LY T776, LB T776 LHGB T686 LT T68C, LB T68C - Hyper Mini TOPLED® LB M676 - Mini TOPLED Santana® LG M470 LS M47K, LO M47K, LY M47K Source: http://www.osram.convergy.de LUXEON: - LUMILED® LXK2-PW12-R00, LXK2-PW12-S00, LXK2-PW14-U00, LXK2-PW14-V00 LXK2-PM12-R00, LXK2-PM12-S00, LXK2-PM14-U00 LXK2-PE12-Q00, LXK2-PE12-R00, LXK2-PE12-S00, LXK2-PE14-T00, LXK2-PE14-U00 LXK2-PB12-K00, LXK2-PB12-L00, LXK2-PB12-M00, LXK2-PB14-N00, LXK2-PB14-P00, LXK2-PB14-Q00 LXK2-PR12-L00, LXK2-PR12-M00, LXK2-PR14-Q00, LXK2-PR14-R00 LXK2-PD12-Q00, LXK2-PD12-R00, LXK2-PD12-S00 LXK2-PH12-R00, LXK2-PH12-S00 LXK2-PL12-P00, LXK2-PL12-Q00, LXK2-PL12-R00 Source: www.luxeon.com KINGBRIGHT: KA-3528ASYC Source: www.kingbright.com; OC_REICHELT: SMD-LED 0805 RT
OK30-OK32 = ACPL-M50L:ACPL-M50L; OC_DIGIKEY: 516-2166-5-ND
OK101-OK115 = optocoupler:LTV816: OPTO COUPLER Source: LITEON, LTV816.pdf; OC_FARNELL: unknown; OC_NEWARK: unknown
OK116 = optocoupler:LTV816: OPTO COUPLER Source: LITEON, LTV816.pdf; OC_FARNELL: unknown; OC_NEWARK: unknown; OC_REICHELT: LTV 356T-SMD
Q1 = crystal:MC-306: kHz RANGE CRYSTAL UNIT SMD Source: MC-306_405_406_E07X.PDF Homepage <http://www.epsontoyocom.co.jp>; MPN: MC-306 60.0KHZ 100PPM ,12.5PF; OC_FARNELL: 1278040; OC_NEWARK: 31M5576; OC_REICHELT: 0,032768-SMD
Q2 = Crystals-new:CRYSTAL; OC_REICHELT: 16,000000-MJ
R1-R4 R34-R36 = resistor:R-EU_: RESISTOR, European symbol; OC_REICHELT: SMD-0805 1,00K
R5-R8 R10 = rcl:R-EU_: RESISTOR, European symbol; OC_REICHELT: SMD-0805 220
R9 = rcl:R-EU_: RESISTOR, European symbol; OC_REICHELT: SMD-0805 1,50K
R11 R37-R39 R72 R201-R216 = resistor:R-EU_: RESISTOR, European symbol; OC_REICHELT: SMD-0805 10,0K
R12 = rcl:R-EU_: RESISTOR, European symbol; OC_REICHELT: SMD-0805 120
R13 R14 = rcl:R-EU_: RESISTOR, European symbol; OC_REICHELT: SMD-0805 680
R15-R17 = resistor:R-EU_: RESISTOR, European symbol
R73-R75 = resistor:R-EU_: RESISTOR, European symbol; OC_REICHELT: SMD-0805 220
R101-R116 = resistor:R-EU_: RESISTOR, European symbol; OC_REICHELT: SMD-0805 1,20K
R221-R236 = resistor:R-EU_: RESISTOR, European symbol; OC_REICHELT: SMD-0805 47,0K
U1 = SparkFun:MAX232: RS232 Transceiver Very common IC. This is generically called 'MAX232', but works with the 3V equivalent MAX3232 generic ICs. Field tested and mother approved. Spark Fun Electronics SKU : COM-00316 (DIP) and COM-00589 (SMD); OC_REICHELT: MAX 232 CSE SMD
ULN1-ULN4 = SparkFun:ULN2803: Darlington Driver ULN2803 Darlington array. 500mA max per channel, 8-channel package. Spark Fun Electronics SKU : COM-00312; OC_REICHELT: ULN 2803 D
X1 X2 X5 = con-wago_3.5mm:713-1410: Serie 713, Stiftleiste (für Leiterplatten) Einlötstift gerade 0,8 x 0,8 mm / Series 713, Male header (for PCBs) Straight solder pin 0.8 x 0.8 mm Polzahl / Pole No.: 20 Bemessungsspannung / Rated Voltage: 160 V Nennstrom / Nominal Current: 10 A Lötstiftlänge: / Solder Pin Length: 3.8 mm Farbe / Color: schwarz / black Stand: 01.01.2012. Die jeweils aktuellen Daten zu diesem Artikel finden Sie in unserem Produktkatalog, den Sie unter www.wago.com einsehen können. As of: 01/01/2012. Please find the newest data for this article in our product catalogue, which can be viewed under www.wago.com.; OC_REICHELT: WAGO 713-1410
X3 X7 = con-wago_2.5mm:733-333: Serie 733, Stiftleiste (für Leiterplatten) Einlötstift gerade 0,8 x 0,8 mm / Series 733, Male header (for PCBs) Straight solder pin 0.8 x 0.8 mm Polzahl / Pole No.: 3 Rastermaß / Pitch: 2.5 mm Bemessungsspannung / Rated Voltage: 160 V Nennstrom / Nominal Current: 6 A Lötstiftlänge: / Solder Pin Length: 4.6 mm Farbe / Color: lichtgrau / light grey Stand: 01.01.2012. Die jeweils aktuellen Daten zu diesem Artikel finden Sie in unserem Produktkatalog, den Sie unter www.wago.com einsehen können. As of: 01/01/2012. Please find the newest data for this article in our product catalogue, which can be viewed under www.wago.com.; OC_REICHELT: WAGO 733-333
X4 = con-wago_2.5mm:733-332: Serie 733, Stiftleiste (für Leiterplatten) Einlötstift gerade 0,8 x 0,8 mm / Series 733, Male header (for PCBs) Straight solder pin 0.8 x 0.8 mm Polzahl / Pole No.: 2 Rastermaß / Pitch: 2.5 mm Bemessungsspannung / Rated Voltage: 160 V Nennstrom / Nominal Current: 6 A Lötstiftlänge: / Solder Pin Length: 4.6 mm Farbe / Color: lichtgrau / light gray Stand: 01.01.2012. Die jeweils aktuellen Daten zu diesem Artikel finden Sie in unserem Produktkatalog, den Sie unter www.wago.com einsehen können. As of: 01/01/2012. Please find the newest data for this article in our product catalogue, which can be viewed under www.wago.com.
X6 = con-wago_2.5mm:733-334: Serie 733, Stiftleiste (für Leiterplatten) Einlötstift gerade 0,8 x 0,8 mm / Series 733, Male header (for PCBs) Straight solder pin 0.8 x 0.8 mm Polzahl / Pole No.: 4 Rastermaß / Pitch: 2.5 mm Bemessungsspannung / Rated Voltage: 160 V Nennstrom / Nominal Current: 6 A Lötstiftlänge: / Solder Pin Length: 4.6 mm Farbe / Color: lichtgrau / light gray Stand: 01.01.2012. Die jeweils aktuellen Daten zu diesem Artikel finden Sie in unserem Produktkatalog, den Sie unter www.wago.com einsehen können. As of: 01/01/2012. Please find the newest data for this article in our product catalogue, which can be viewed under www.wago.com.; OC_REICHELT: WAGO 733-334
X9 = con-subd:F09VP: SUB-D; OC_FARNELL: unknown; OC_NEWARK: unknown; OC_REICHELT: D-SUB BU 09P

## Net classes
1 24v-2a: width 0.508 mm, clearance 0.102 mm
2 24v-500ma: width 0.254 mm, clearance 0.102 mm